# EAGLE design opl3_nano_shield (EAGLE 4.16)
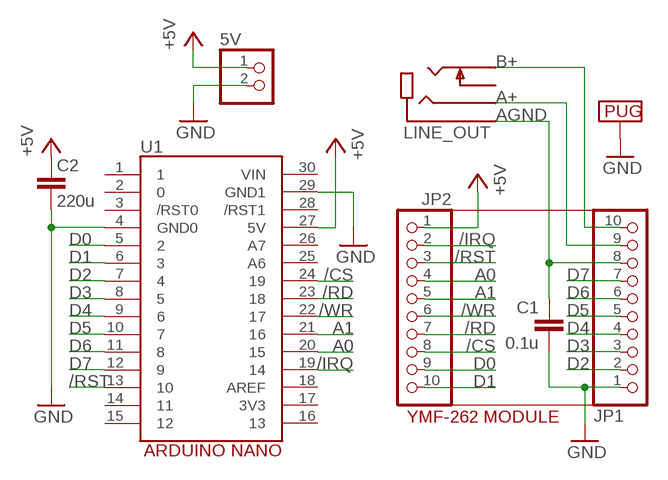
[diagram p0: schematic, sheet 1]

## Parts
5V  PINHD-1X2  [1X02]
C1  0.1u  C-EUC0603  [C0603]
C2  220u  C-EUC1206  [C1206]
JP1  PINHD-1X10  [1X10]
JP2  PINHD-1X10  [1X10]
LINE_OUT  HPHONE_SWITCH_SJ-3524-SMT-TR_  [HPHONE_CUI_SJ-3524-SMT-TR]
U1  ARDUINO_NANO  [ARDUINO_NANO]
U$1  PUGSMALL  [SMALL_PUG]

## Nets
+5V [pwr]: 5V.1 C2.2 JP2.1 U1.27(5V)
/CS: JP2.8 U1.24
/IRQ: JP2.2 U1.19
/RD: JP2.7 U1.23
/RST: JP2.3 U1.13
/WR: JP2.6 U1.22
A0: JP2.4 U1.20
A1: JP2.5 U1.21
A+: JP1.9 LINE_OUT.RING
AGND [pwr]: C1.1 JP1.8 LINE_OUT.SLEEVE
B+: JP1.10 LINE_OUT.TIP
D0: JP2.9 U1.5
D1: JP2.10 U1.6
D2: JP1.2 U1.7
D3: JP1.3 U1.8
D4: JP1.4 U1.9
D5: JP1.5 U1.10
D6: JP1.6 U1.11
D7: JP1.7 U1.12
GND: 5V.2 C1.2 C2.1 JP1.1 U1.4(GND0) U1.29(GND1) U$1.P$1
Unconnected: LINE_OUT.SWITCH(SW) U1.1 U1.2 U1.3(/RST0) U1.14 U1.15 U1.16 U1.17(3V3) U1.18(AREF) U1.25(A6) U1.26(A7) U1.28(/RST1) U1.30(VIN)

## Notes on the sheet
- YMF-262 MODULE

## Library data of the parts
5V = pinhead:PINHD-1X2: PIN HEADER
C1 C2 = rcl:C-EU: CAPACITOR, European symbol
JP1 JP2 = pinhead:PINHD-1X10: PIN HEADER
LINE_OUT = 01-hacker-daw:HPHONE_SWITCH
U1 = 02_atmel:ARDUINO_NANO
U$1 = 07-Retrocomputing:PUG

## Net classes
1 pwr: width 0.406 mm, drill 0.203 mm

## Board
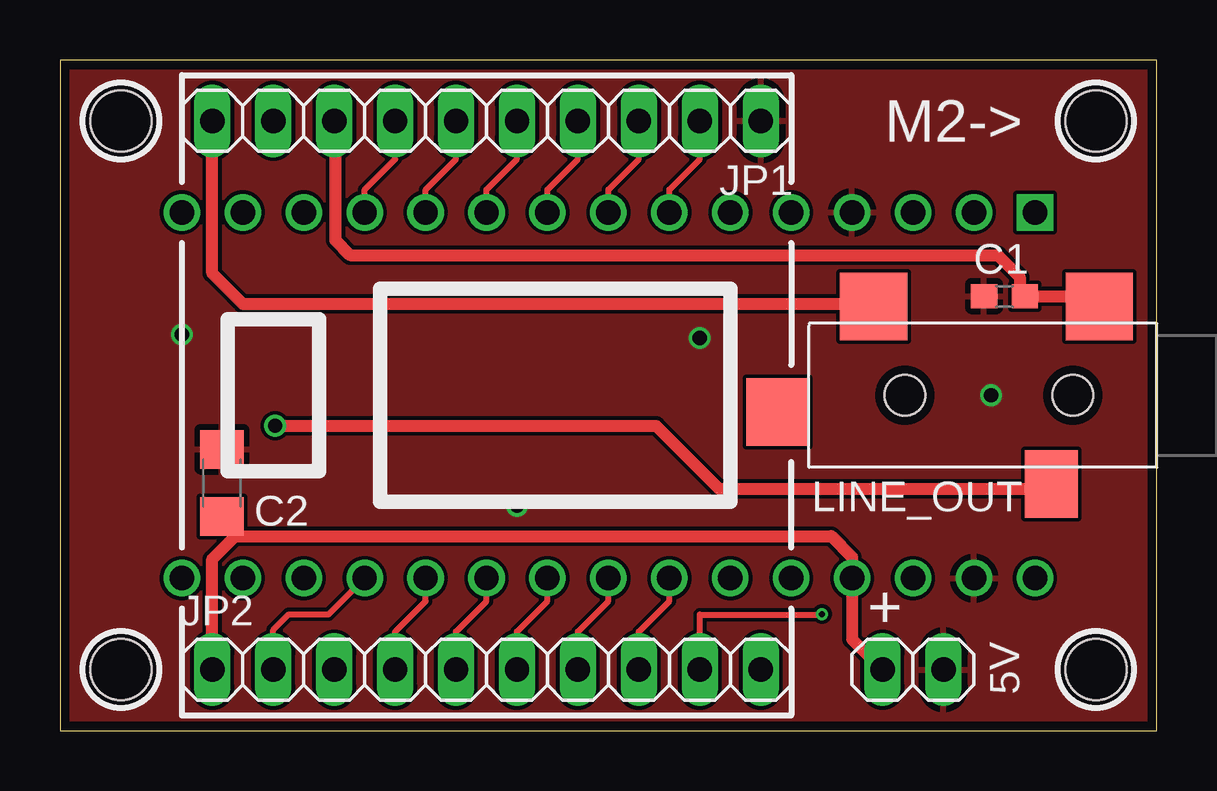
[diagram p1: board, top side]
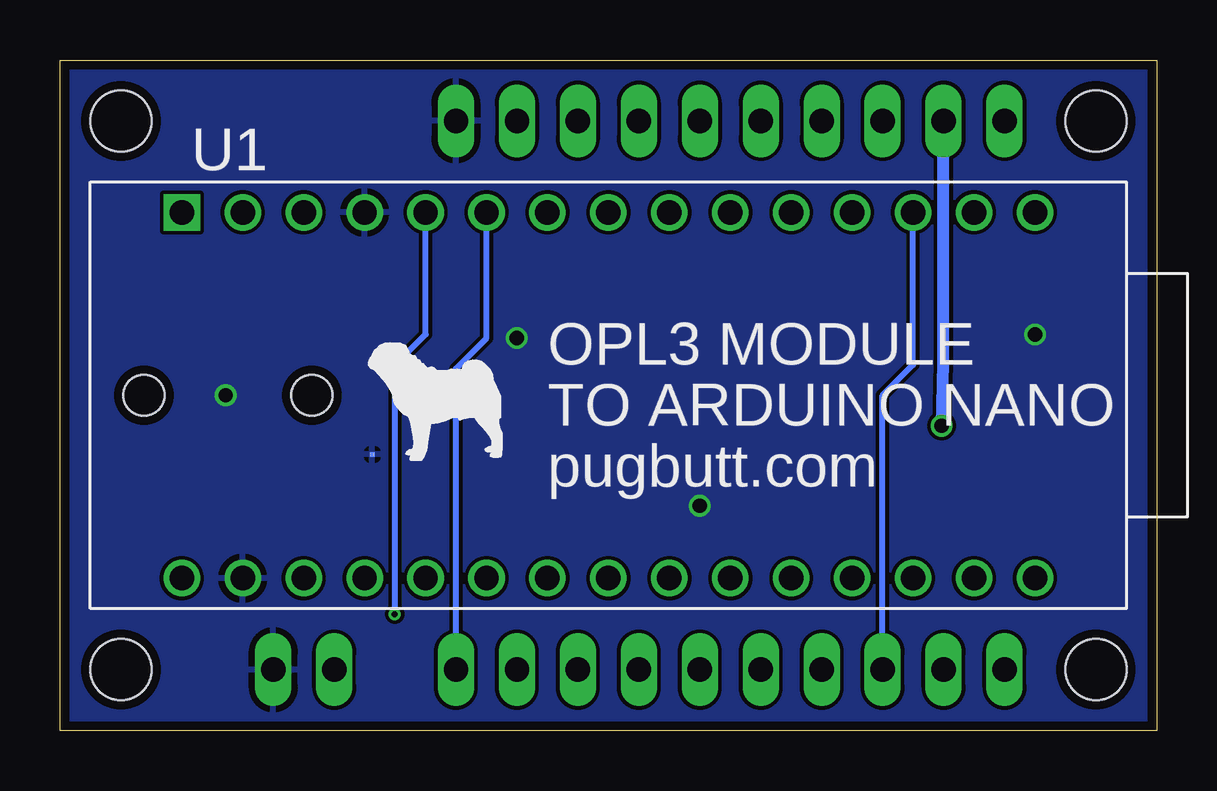
[diagram p2: board, bottom side, seen from below]

Size 45.72 x 27.94 mm. Coordinates in mm from the lower left corner, seen from the top.
Outline: 0,0 45.72,0 45.72,27.94 0,27.94 0,0
Copper layers (1*16): Top 0.0356mm / dielectric 1.6mm / Bottom 0.0356mm
Design rules "oshpark-2layer": minimum track width 6mil, minimum drill 10mil, track to track 6mil, track to pad 6mil, pad to pad 6mil, via to via 6mil, smd to smd 6mil, copper to edge 15mil, drill to drill 6mil, minimum pad ring 5mil, minimum via ring 5mil, stop-mask expansion 2.5mil, vias tented up to drill 0mil, thermal gap 10mil
Holes 2.54 mm at 43.18,25.4 43.18,2.54 2.54,2.54 2.54,25.4

### Footprints (pad centres in the part's own frame; a part is rotated, then mirrored left to right if it is on the bottom)
1X02 = drill 1.016 long: 1 -1.27,0; 2 1.27,0
C0603 = smd 1.1 x 1: 1 -0.85,0; 2 0.85,0
C1206 = smd 1.6 x 1.8: 1 -1.4,0; 2 1.4,0
1X10 = drill 1.016 long: 1 -11.43,0; 2 -8.89,0; 3 -6.35,0; 4 -3.81,0; 5 -1.27,0; 6 1.27,0; 7 3.81,0; 8 6.35,0; 9 8.89,0; 10 11.43,0
HPHONE_CUI_SJ-3524-SMT-TR = smd 2.2 x 2.8: RING 4.4,3.7 | smd 2.8 x 2.8: SLEEVE 2.4,-3.7; TIP 11.8,-3.7 | smd 2.6 x 2.8: SWITCH 15.8,0.7 | hole 1.7: 3.5,0; 10.5,0
ARDUINO_NANO = drill 1.016 square: 1 17.78,7.62 | drill 1.016 round: 2 15.24,7.62; 3 12.7,7.62; 4 10.16,7.62; 5 7.62,7.62; 6 5.08,7.62; 7 2.54,7.62; 8 0,7.62; 9 -2.54,7.62; 10 -5.08,7.62; 11 -7.62,7.62; 12 -10.16,7.62; 13 -12.7,7.62; 14 -15.24,7.62; 15 -17.78,7.62; 16 -17.78,-7.62; 17 -15.24,-7.62; 18 -12.7,-7.62; 19 -10.16,-7.62; 20 -7.62,-7.62; 21 -5.08,-7.62; 22 -2.54,-7.62; 23 0,-7.62; 24 2.54,-7.62; 25 5.08,-7.62; 26 7.62,-7.62; 27 10.16,-7.62; 28 12.7,-7.62; 29 15.24,-7.62; 30 17.78,-7.62
SMALL_PUG = smd 0.203 x 0.203: P$1 0.559,1.105

### Placement (x,y rotation side)
5V  35.56,2.54 0 top
C1  39.37,18.1 180 top
C2  6.75,10.32 270 top
JP1  17.78,25.4 180 top
JP2  17.78,2.54 0 top
LINE_OUT  45.72,13.97 180 top
U1  22.86,13.97 0 top
U$1  33.26,10.4 0 bottom

### Tracks (layer width: path | path; a pad name or v marks a point on that pad's centre or on a via)
+5V
  Top 0.406: 6.75,8.65 C2.2
  Top 0.508: JP2.1 6.35,7.14 7.3,8.1 | 7.3,8.1 32.15,8.1 33.02,7.22 U1.27 33.02,3.81 5V.1 | 7.3,8.1 6.75,8.65
/CS
  Top 0.254: JP2.8 24.13,4.13 25.4,5.4 U1.24
/IRQ
  Top 0.254: JP2.2 8.89,4.19 9.54,4.84 11.19,4.84 U1.19
/RD
  Top 0.254: JP2.7 21.59,4.13 22.86,5.4 U1.23
/RST
  Bottom 0.254: JP2.3 11.43,13.97 10.16,15.24 U1.13
/WR
  Top 0.254: JP2.6 19.05,4.13 20.32,5.4 U1.22
A0
  Top 0.254: JP2.4 13.97,4.13 15.24,5.4 U1.20
A1
  Top 0.254: JP2.5 16.51,4.13 17.78,5.4 U1.21
A+  (via drill 0.6)
  Top 0.508: v8.97,12.7 24.84,12.7 27.46,10.08 40.96,10.08 41.2,10.32 | 41.24,10.27 LINE_OUT.RING
  Top 0.61: 41.2,10.32 41.24,10.27
  Bottom 0.508: JP1.9 8.89,15.32 v8.97,12.7
AGND
  Top 0.406: 11.48,23.93 JP1.8
  Top 0.508: 11.48,23.93 11.48,20.42 12.09,19.81 39.08,19.81 40.01,18.89 40.01,18.34 40.24,18.1 | 40.24,18.1 C1.1 | LINE_OUT.SLEEVE 43.32,17.68 43.34,17.7 42.94,18.1 40.24,18.1
B+
  Top 0.508: JP1.10 6.35,19.05 7.62,17.78 33.89,17.78 | 33.92,17.75 LINE_OUT.TIP
  Top 0.61: 33.89,17.78 33.92,17.75
D0  (via drill 0.25)
  Top 0.254: JP2.9 26.67,4.83 31.73,4.83 v31.76,4.85 v31.77,4.85
  Bottom 0.254: U1.5 30.48,16.51 31.75,15.24 31.75,4.84 v31.76,4.85 v31.77,4.85
D1
  Bottom 0.254: JP2.10 29.21,15.08 27.94,16.35 U1.6
D2
  Top 0.254: U1.7 25.4,22.54 26.67,23.81 JP1.2
D3
  Top 0.254: U1.8 22.86,22.54 24.13,23.81 JP1.3
D4
  Top 0.254: U1.9 20.32,22.54 21.59,23.81 JP1.4
D5
  Top 0.254: U1.10 17.78,22.54 19.05,23.81 JP1.5
D6
  Top 0.254: U1.11 15.24,22.54 16.51,23.81 JP1.6
D7
  Top 0.254: U1.12 12.7,22.54 13.97,23.81 JP1.7
GND  (via drill 0.6)
  other vias: 5.08,16.51 38.81,13.97 26.67,16.35 19.05,9.37
  pour Top: 45.72,27.94 0,27.94 0,0 45.72,0
  pour Bottom: 45.72,27.94 0,27.94 0,0 45.72,0

### Text on the board
tNames: M2-> | +
bNames: OPL3 MODULE | TO ARDUINO NANO | pugbutt.com